# Altium schematic sheet DAQ Connector.SchDoc
size A
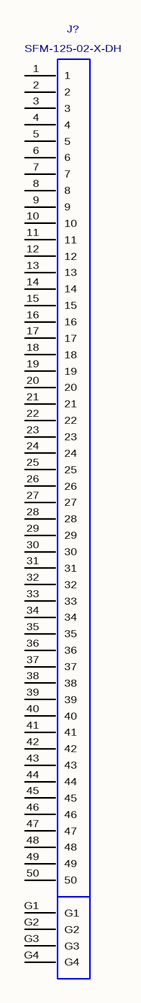
[diagram p0: DAQ Connector.SchDoc]

## Parts
J?  SFM-125-02-X-DH  [SFM-125-02-X-DH]

## Nets

Not connected (* = marked no-connect by the designer): J? 1 2 3 4 5 6 7 8 9 10 11 12 13 14 15 16 17 18 19 20 21 22 23 24 25 26 27 28 29 30 31 32 33 34 35 36 37 38 39 40 41 42 43 44 45 46 47 48 49 50 G1 G2 G3 G4

## Library data of the parts
J? = SFM-125-02-X-DH: .050" (1,27mm) Tiger Eye Contact, Molded-to-Position Socket Strip, Double Horizontal.; MANUFACTURER: SAMTEC; CREATED: October 28, 2015 - Wendy Xin; PCB DECAL: SFM-125-02-X-DH